# EAGLE design flute (EAGLE 6.1)
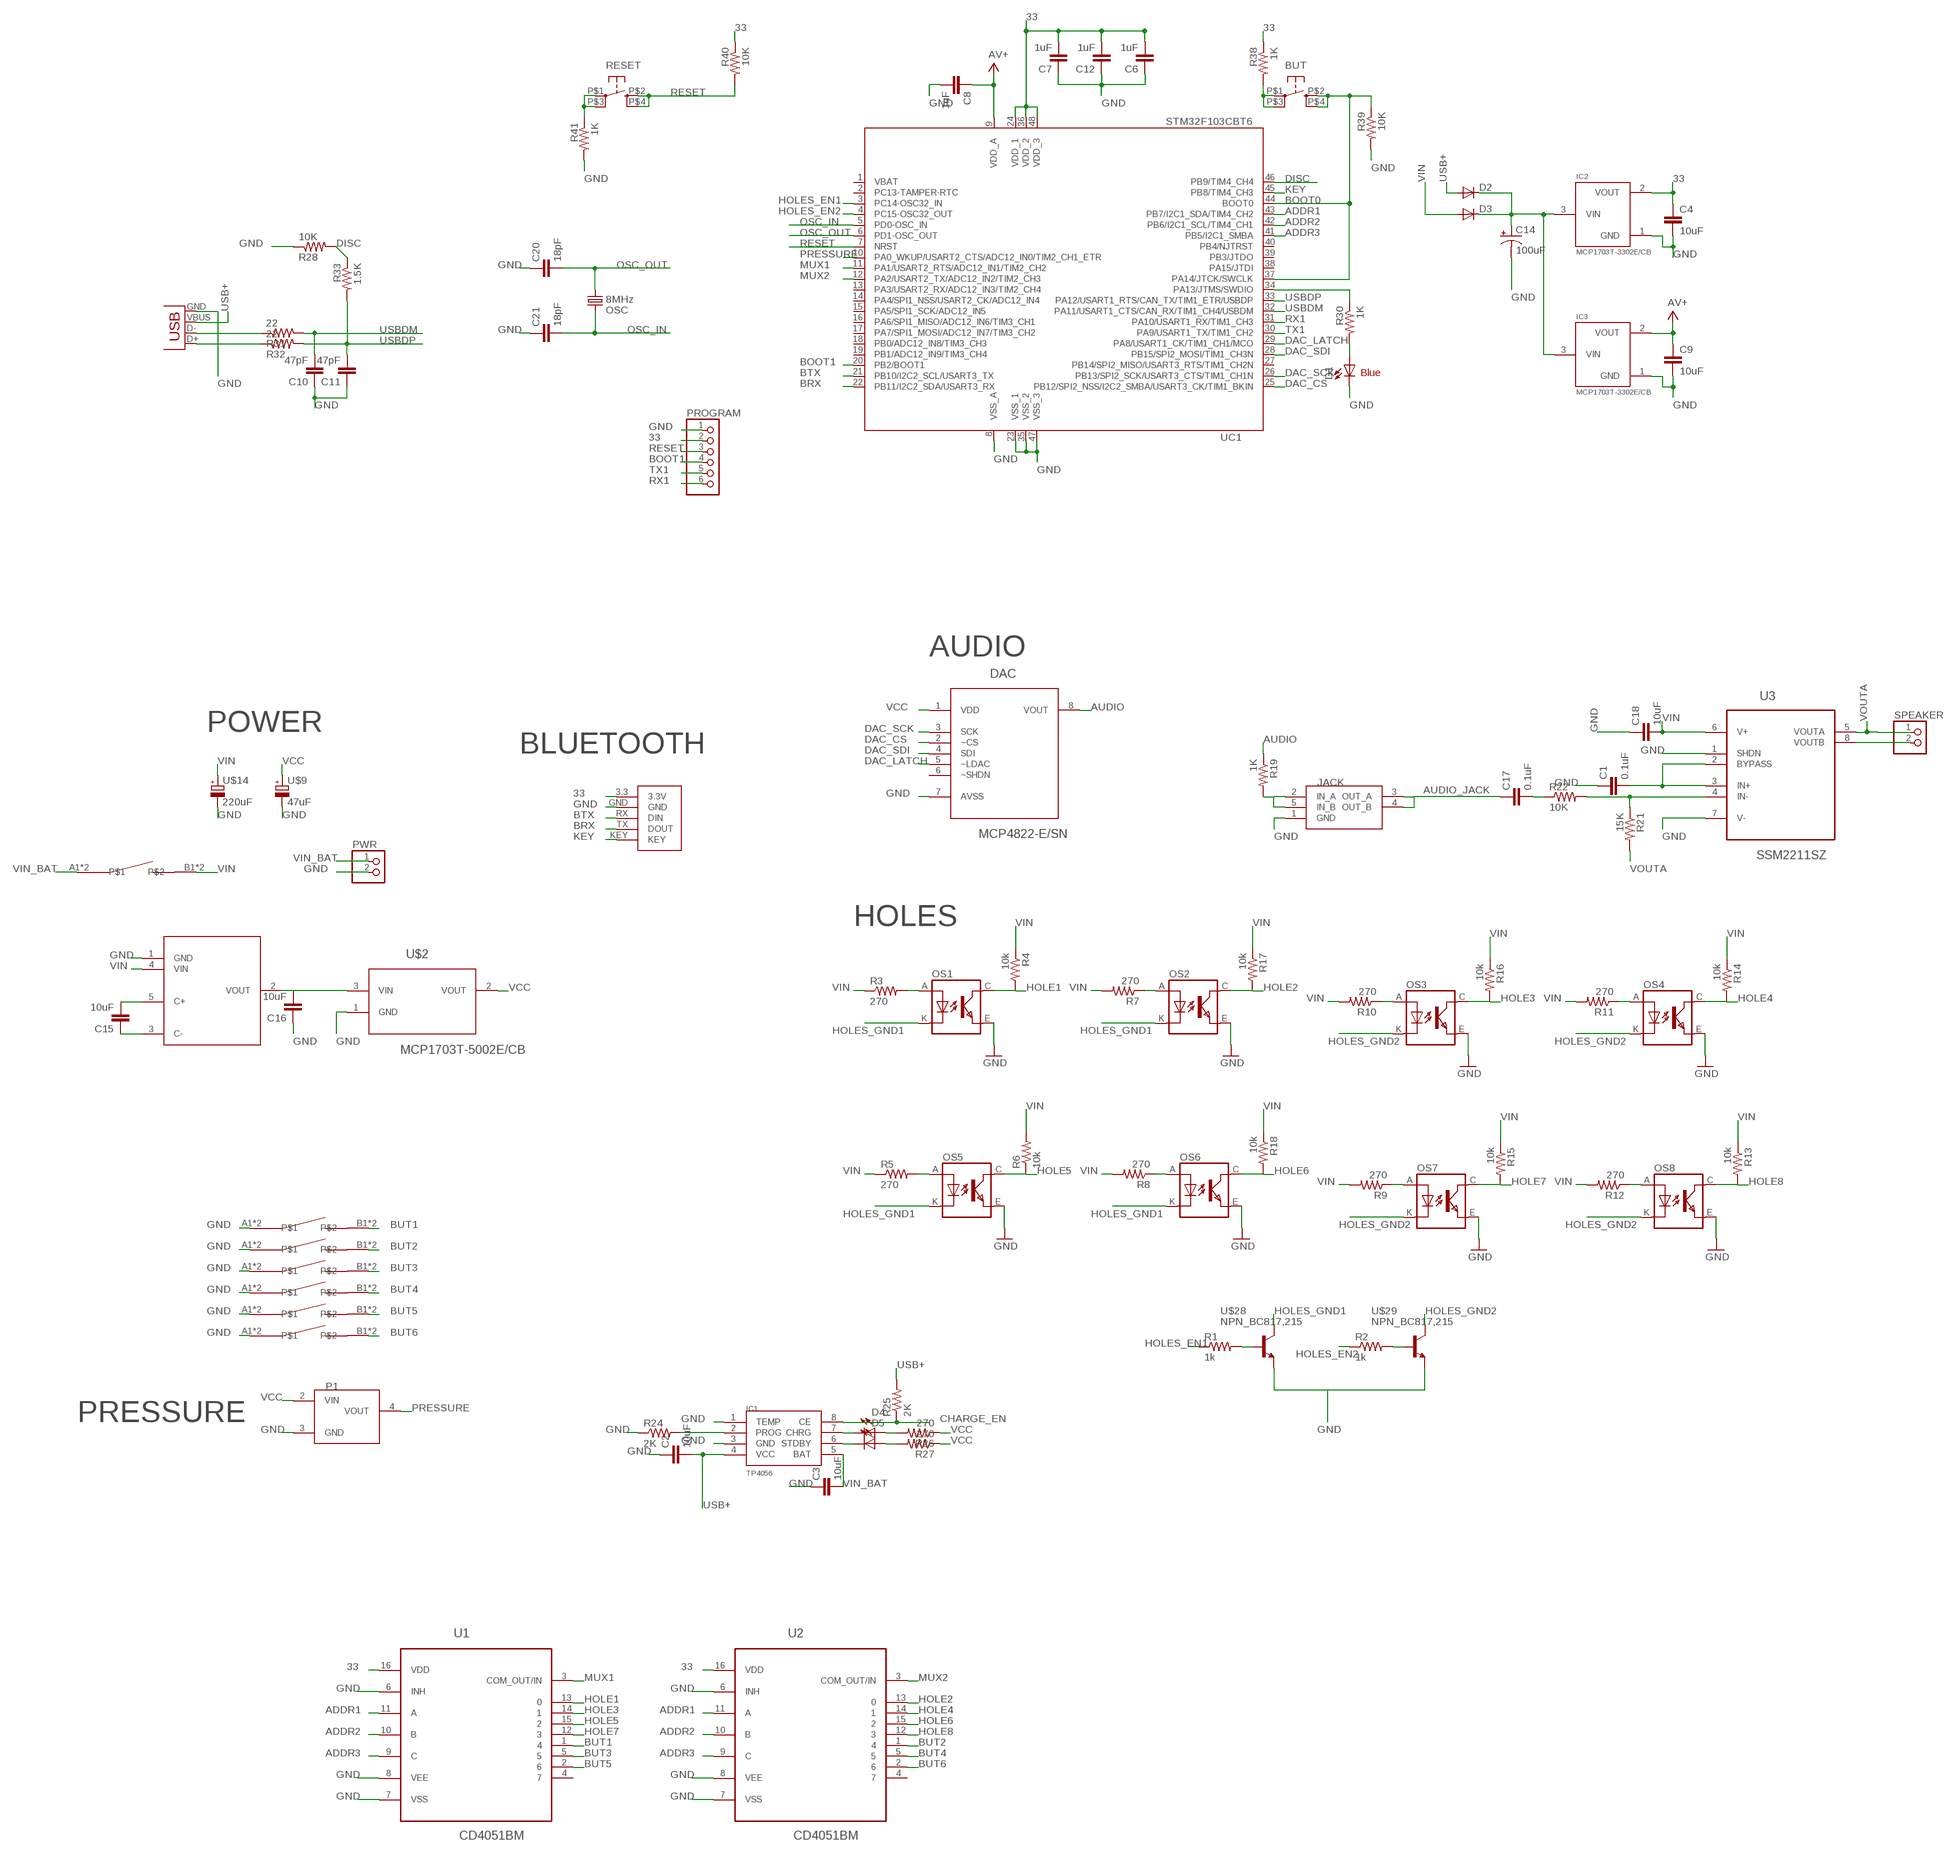
[diagram p0: schematic, sheet 1]

## Parts
BUT  KMR211GLFS  BUTTON-KMR241GLFS  [PUSHBUTTON-KMR241GLFS]
C1  0.1uF  CAP0805  [0805]
C2  10uF  CAP0805  [0805]
C3  10uF  CAP0805  [0805]
C4  10uF  CAP0805  [0805]
C6  1uF  CAP0805  [0805]
C7  1uF  CAP0805  [0805]
C8  1uF  CAP0805  [0805]
C9  10uF  CAP0805  [0805]
C10  47pF  CAP0805  [0805]
C11  47pF  CAP0805  [0805]
C12  1uF  CAP0805  [0805]
C14  100uF  CAP_POL1206  [EIA3216]
C15  10uF  CAP0805  [0805]
C16  10uF  CAP0805  [0805]
C17  0.1uF  CAP0805  [0805]
C18  10uF  CAP0805  [0805]
C20  18pF  CAP0805  [0805]
C21  18pF  CAP0805  [0805]
D1  Blue  LED1206  [LED-1206]
D2  DIODESOD  [SOD-323]
D3  DIODESOD  [SOD-323]
D4  Red  LED1206  [LED-1206]
D5  Green  LED1206  [LED-1206]
DAC  MCP4822-E/SN  [SOIC8-N_MC]
IC1  TP4056  [SOP-8]
IC2  MCP1703T-3302E/CB  MCP1700T  [SOT23]
IC3  MCP1703T-3302E/CB  MCP1700T  [SOT23]
JACK  JACK  [3F07]
OS1  TCRT5000  [TCRT5000]
OS2  TCRT5000  [TCRT5000]
OS3  TCRT5000  [TCRT5000]
OS4  TCRT5000  [TCRT5000]
OS5  TCRT5000  [TCRT5000]
OS6  TCRT5000  [TCRT5000]
OS7  TCRT5000  [TCRT5000]
OS8  TCRT5000  [TCRT5000]
OSC  8MHz  CRYSTAL5X3  [CRYSTAL-SMD-5X3]
P1  PRESSURE_SENSOR  [MPXV5050GP]
PROGRAM  CONNEC_1X066PADS  [6PADS]
PWR  CONNEC_1X02BASIC  [CONNEC_1X02]
R1  1k  RESISTOR0805-RES  [0805]
R2  1k  RESISTOR0805-RES  [0805]
R3  270  RESISTOR0805-RES  [0805]
R4  10k  RESISTOR0805-RES  [0805]
R5  270  RESISTOR0805-RES  [0805]
R6  10k  RESISTOR0805-RES  [0805]
R7  270  RESISTOR0805-RES  [0805]
R8  270  RESISTOR0805-RES  [0805]
R9  270  RESISTOR0805-RES  [0805]
R10  270  RESISTOR0805-RES  [0805]
R11  270  RESISTOR0805-RES  [0805]
R12  270  RESISTOR0805-RES  [0805]
R13  10k  RESISTOR0805-RES  [0805]
R14  10k  RESISTOR0805-RES  [0805]
R15  10k  RESISTOR0805-RES  [0805]
R16  10k  RESISTOR0805-RES  [0805]
R17  10k  RESISTOR0805-RES  [0805]
R18  10k  RESISTOR0805-RES  [0805]
R19  1K  RESISTOR0805-RES  [0805]
R21  15K  RESISTOR0805-RES  [0805]
R22  10K  RESISTOR0805-RES  [0805]
R24  2K  RESISTOR0805-RES  [0805]
R25  2K  RESISTOR0805-RES  [0805]
R26  270  RESISTOR0805-RES  [0805]
R27  270  RESISTOR0805-RES  [0805]
R28  10K  RESISTOR0805-RES  [0805]
R30  1K  RESISTOR0805-RES  [0805]
R31  22  RESISTOR0805-RES  [0805]
R32  22  RESISTOR0805-RES  [0805]
R33  1.5K  RESISTOR0805-RES  [0805]
R38  1K  RESISTOR0805-RES  [0805]
R39  10K  RESISTOR0805-RES  [0805]
R40  10K  RESISTOR0805-RES  [0805]
R41  1K  RESISTOR0805-RES  [0805]
RESET  KMR211GLFS  BUTTON-KMR241GLFS  [PUSHBUTTON-KMR241GLFS]
SPEAKER  CONNEC_1X02BASIC  [CONNEC_1X02]
U1  CD4051BM  [SOIC127P600X175-16N]
U2  CD4051BM  [SOIC127P600X175-16N]
U3  SSM2211SZ  [SOIC127P600X175-8N]
U$1  MAX1683  [SOT23-5]
U$2  MCP1703T-5002E/CB  [SOT95P300X145-3N]
U$9  47uF  CPOL_EUPANASONIC_D  [PANASONIC_D]
U$14  220uF  CPOL_EUPANASONIC_D8  [PANASONIC_D8]
U$16  SWITCHKCD11  [KCD11]
U$18  SWITCH6X6X10  [SWITCH_6X6X10]
U$19  SWITCH6X6X10  [SWITCH_6X6X10]
U$20  SWITCH6X6X10  [SWITCH_6X6X10]
U$21  SWITCH6X6X10  [SWITCH_6X6X10]
U$22  SWITCH6X6X10  [SWITCH_6X6X10]
U$23  SWITCH6X6X10  [SWITCH_6X6X10]
U$24  HC05  [HC-05]
U$28  NPN_BC817,215  [SOT-23]
U$29  NPN_BC817,215  [SOT-23]
UC1  STM32F103CBT6  STM32F103CB  [LQFP48]
X1  USB-MINIB  USBSMD  [USB-MINIB]

## Nets
32: BUT.P$2 BUT.P$4 R39.1 UC1.37(PA14/JTCK/SWCLK) UC1.44(BOOT0)
33: C4.1 C6.2 C7.2 C12.2 IC2.2(VOUT) PROGRAM.2 R38.1 R40.1 U1.16(VDD) U2.16(VDD) U$24.3.3(3.3V) UC1.24(VDD_1) UC1.36(VDD_2) UC1.48(VDD_3)
ADDR1: U1.11(A) U2.11(A) UC1.43(PB7/I2C1_SDA/TIM4_CH2)
ADDR2: U1.10(B) U2.10(B) UC1.42(PB6/I2C1_SCL/TIM4_CH1)
ADDR3: U1.9(C) U2.9(C) UC1.41(PB5/I2C1_SMBA)
AUDIO: DAC.8(VOUT) R19.1
AUDIO_JACK: C17.1 JACK.3(OUT_A) JACK.4(OUT_B)
AV+: C8.1 C9.1 IC3.2(VOUT) UC1.9(VDD_A)
BOOT1: PROGRAM.4 UC1.20(PB2/BOOT1)
BRX: U$24.TX(DOUT) UC1.22(PB11/I2C2_SDA/USART3_RX)
BTX: U$24.RX(DIN) UC1.21(PB10/I2C2_SCL/USART3_TX)
BUT1: U1.1 U$18.B1 U$18.B2
BUT2: U2.1 U$19.B1 U$19.B2
BUT3: U1.5 U$20.B1 U$20.B2
BUT4: U2.5 U$21.B1 U$21.B2
BUT5: U1.2 U$22.B1 U$22.B2
BUT6: U2.2 U$23.B1 U$23.B2
CHARGE_EN: IC1.8(CE) R25.1
DAC_CS: DAC.2(~CS) UC1.25(PB12/SPI2_NSS/I2C2_SMBA/USART3_CK/TIM1_BKIN)
DAC_LATCH: DAC.5(~LDAC) UC1.29(PA8/USART1_CK/TIM1_CH1/MCO)
DAC_SCK: DAC.3(SCK) UC1.26(PB13/SPI2_SCK/USART3_CTS/TIM1_CH1N)
DAC_SDI: DAC.4(SDI) UC1.28(PB15/SPI2_MOSI/TIM1_CH3N)
DISC: R28.2 R33.1 UC1.46(PB9/TIM4_CH4)
GND [alim]: C1.1 C2.1 C3.1 C4.2 C6.1 C7.1 C8.2 C9.2 C10.1 C11.1 C12.1 C14.C(-) C16.1 C18.1 C20.1 C21.1 D1.C DAC.7(AVSS) IC1.1(TEMP) IC1.3(GND) IC2.1(GND) IC3.1(GND) JACK.1(GND) OS1.E(EMITTER) OS2.E(EMITTER) OS3.E(EMITTER) OS4.E(EMITTER) OS5.E(EMITTER) OS6.E(EMITTER) OS7.E(EMITTER) OS8.E(EMITTER) P1.3(GND) PROGRAM.1 PWR.2 R24.1 R28.1 R39.2 R41.2 U1.6(INH) U1.7(VSS) U1.8(VEE) U2.6(INH) U2.7(VSS) U2.8(VEE) U3.1(SHDN) U3.7(V-) U$1.1(GND) U$2.1(GND) U$9.- U$14.- U$18.A1 U$18.A2 U$19.A1 U$19.A2 U$20.A1 U$20.A2 U$21.A1 U$21.A2 U$22.A1 U$22.A2 U$23.A1 U$23.A2 U$24.GND U$28.2(E) U$29.2(E) UC1.8(VSS_A) UC1.23(VSS_1) UC1.35(VSS_2) UC1.47(VSS_3) X1.GND
HOLE1: OS1.C(COLLECTOR) R4.2 U1.13
HOLE2: OS2.C(COLLECTOR) R17.2 U2.13
HOLE3: OS3.C(COLLECTOR) R16.2 U1.14
HOLE4: OS4.C(COLLECTOR) R14.2 U2.14
HOLE5: OS5.C(COLLECTOR) R6.1 U1.15
HOLE6: OS6.C(COLLECTOR) R18.2 U2.15
HOLE7: OS7.C(COLLECTOR) R15.2 U1.12
HOLE8: OS8.C(COLLECTOR) R13.2 U2.12
HOLES_EN1: R1.1 UC1.3(PC14-OSC32_IN)
HOLES_EN2: R2.1 UC1.4(PC15-OSC32_OUT)
HOLES_GND1: OS1.K(CATHODE) OS2.K(CATHODE) OS5.K(CATHODE) OS6.K(CATHODE) U$28.3(C)
HOLES_GND2: OS3.K(CATHODE) OS4.K(CATHODE) OS7.K(CATHODE) OS8.K(CATHODE) U$29.3(C)
KEY: U$24.KEY UC1.45(PB8/TIM4_CH3)
MUX1: U1.3(COM_OUT/IN) UC1.11(PA1/USART2_RTS/ADC12_IN1/TIM2_CH2)
MUX2: U2.3(COM_OUT/IN) UC1.12(PA2/USART2_TX/ADC12_IN2/TIM2_CH3)
N$1: C1.2 U3.2(BYPASS) U3.3(IN+)
N$2: R21.1 R22.2 U3.4(IN-)
N$3: R1.2 U$28.1(B)
N$4: R2.2 U$29.1(B)
N$5: OS1.A(ANODE) R3.2
N$6: D5.A R27.2
N$7: OS2.A(ANODE) R7.1
N$8: JACK.2(IN_A) JACK.5(IN_B) R19.2
N$9: OS3.A(ANODE) R10.1
N$10: C17.2 R22.1
N$11: OS4.A(ANODE) R11.1
N$12: SPEAKER.2 U3.8(VOUTB)
N$13: OS5.A(ANODE) R5.2
N$15: OS6.A(ANODE) R8.1
N$16: D4.A R26.2
N$17: OS7.A(ANODE) R9.1
N$19: OS8.A(ANODE) R12.1
N$21: IC1.2(PROG) R24.2
N$22: C15.1 U$1.3(C-)
N$24: D4.C IC1.7(CHRG)
N$25: D5.C IC1.6(STDBY)
N$26: BUT.P$1 BUT.P$3 R38.2
N$27: R41.1 RESET.P$1 RESET.P$3
N$28: D1.A R30.2
N$29: R30.1 UC1.34(PA13/JTMS/SWDIO)
N$30: C15.2 U$1.5(C+)
N$31: C16.2 U$1.2(VOUT) U$2.3(VIN)
N$59: R31.1 X1.D-
N$60: R32.1 X1.D+
OSC_IN: C21.2 OSC.3 UC1.5(PD0-OSC_IN)
OSC_OUT: C20.2 OSC.1 UC1.6(PD1-OSC_OUT)
PRESSURE: P1.4(VOUT) UC1.10(PA0_WKUP/USART2_CTS/ADC12_IN0/TIM2_CH1_ETR)
RESET: PROGRAM.3 R40.2 RESET.P$2 RESET.P$4 UC1.7(NRST)
RX1: PROGRAM.6 UC1.31(PA10/USART1_RX/TIM1_CH3)
TX1: PROGRAM.5 UC1.30(PA9/USART1_TX/TIM1_CH2)
USB+: C2.2 D2.2(A) IC1.4(VCC) R25.2 X1.VBUS
USBDM: C10.2 R31.2 UC1.32(PA11/USART1_CTS/CAN_RX/TIM1_CH4/USBDM)
USBDP: C11.2 R32.2 R33.2 UC1.33(PA12/USART1_RTS/CAN_TX/TIM1_ETR/USBDP)
VCC [alim]: DAC.1(VDD) P1.2(VIN) R26.1 R27.1 U$2.2(VOUT) U$9.+
VIN [alim]: C18.2 D3.2(A) R3.1 R4.1 R5.1 R6.2 R7.2 R8.2 R9.2 R10.2 R11.2 R12.2 R13.1 R14.1 R15.1 R16.1 R17.1 R18.1 U3.6(V+) U$1.4(VIN) U$14.+ U$16.B1 U$16.B2
VIN_BAT [alim]: C3.2 IC1.5(BAT) PWR.1 U$16.A1 U$16.A2
VIN_REGS [alim]: C14.A(+) D2.1(C) D3.1(C) IC2.3(VIN) IC3.3(VIN)
VOUTA: R21.2 SPEAKER.1 U3.5(VOUTA)
Unconnected: DAC.6(~SHDN) U1.4 U2.4 UC1.2(PC13-TAMPER-RTC) UC1.13(PA3/USART2_RX/ADC12_IN3/TIM2_CH4) UC1.14(PA4/SPI1_NSS/USART2_CK/ADC12_IN4) UC1.15(PA5/SPI1_SCK/ADC12_IN5) UC1.16(PA6/SPI1_MISO/ADC12_IN6/TIM3_CH1) UC1.17(PA7/SPI1_MOSI/ADC12_IN7/TIM3_CH2) UC1.18(PB0/ADC12_IN8/TIM3_CH3) UC1.19(PB1/ADC12_IN9/TIM3_CH4) UC1.27(PB14/SPI2_MISO/USART3_RTS/TIM1_CH2N) UC1.38(PA15/JTDI) UC1.39(PB3/JTDO) UC1.40(PB4/NJTRST)

## Notes on the sheet
- BOOT0
- Blue
- AUDIO
- POWER
- BLUETOOTH
- HOLES
- PRESSURE

## Power pins joined to a net without a drawn wire
VBAT: UC1.1(VBAT)

## Library data of the parts
BUT RESET = okie:BUTTON-KMR241GLFS
C1-C3 C6-C8 C10-C12 C15-C18 C20 C21 = SparkFun-Passives:CAP: Capacitor Standard 0603 ceramic capacitor, and 0.1" leaded capacitor.
C4 C9 = SparkFun2:CAP: Capacitor Standard 0603 ceramic capacitor, and 0.1" leaded capacitor.
C14 = SparkFun3:CAP_POL: Capacitor Polarized These are standard SMD and PTH capacitors. Normally 10uF, 47uF, and 100uF in electrolytic and tantalum varieties. Always verify the external diameter of the through hole cap, it varies with capacity, voltage, and manufacturer. The EIA devices should be standard.
D1 D4 D5 = SparkFun:LED: LEDs Standard schematic elements and footprints for 5mm, 3mm, 1206, and 0603 sized LEDs. 5mm - Spark Fun Electronics SKU : COM-00529 (and others)
D2 D3 = SparkFun3:DIODE: Diode These are standard reverse protection diodes and small signal diodes. SMA package can handle up to about 1A. SOD-323 can handle about 200mA. What the SOD-323 package when ordering, there are some mfgs out there that are 5-pin packages.
DAC = rhoban:MCP4822-E/SN: 12 Bit DAC; DESCRIPTION: 12 Bit DAC; MPN: MCP4822-E/SN; OC_FARNELL: 1439414; OC_NEWARK: 31K2975; PACKAGE: SOIC-8; SUPPLIER: Microchip
IC1 = TP4056:TP4056
IC2 IC3 = okie:MCP1700T
JACK = rhoban:JACK
OS1-OS8 = tcrt5000:TCRT5000
OSC = SparkFun2:CRYSTAL: Crystals Various standard crystals. Proven footprints. Spark Fun Electronics SKU : COM-00534
P1 = rhoban:PRESSURE_SENSOR
PROGRAM = rhoban:CONNEC_1X06
PWR SPEAKER = rhoban:CONNEC_1X02
R1-R19 R21 R22 R24-R28 R30-R33 R38-R41 = SparkFun-Passives:RESISTOR: Resistor Basic schematic elements and footprints for 0603, 1206, and PTH resistors.
U1 U2 = rhoban:CD4051BM: CMOS Analog Multiplexers/Demultiplexers with Logic Level Conversion; MPN: CD4051BM; OC_FARNELL: 8388970; OC_NEWARK: 05B5595; PACKAGE: SOIC-16; SUPPLIER: Texas Instruments
U3 = rhoban:SSM2211SZ: Low Distortion, 1.5 W Audio Power Amplifier; MPN: SSM2211SZ; OC_FARNELL: 9994440; OC_NEWARK: 19M1049; PACKAGE: SOIC-8; SUPPLIER: Analog Devices
U$1 = rhoban:MAX1683
U$2 = rhoban:MCP1703T-5002E/CB: Low Quiescent Current LDO Regulator; MPN: MCP1703T-5002E/CB; OC_FARNELL: 1439519; OC_NEWARK: 40M0640; PACKAGE: SOT-3; SUPPLIER: Microchip
U$9 U$14 = rhoban:CPOL_EU: 47uF: http://fr.farnell.com/panasonic-electronic-components/eee1ca470sp/condensateur-elec-alu-47uf-16v/dp/9696946 220uF: http://fr.farnell.com/panasonic-electronic-components/eeefk1c221xp/condensateur-elec-alu-220uf-16v/dp/1850103
U$16 U$18-U$23 = rhoban:SWITCH
U$24 = rhoban:HC05
U$28 U$29 = rhoban:NPN
UC1 = stm32:STM32F103CB
X1 = SparkFun2:USB: USB Connectors USB-B-PTH is fully proven SKU : PRT-00139 USB-miniB is fully proven SKU : PRT-00587 USB-A-PCB is untested. USB-A-H is throughly reviewed, but untested. Spark Fun Electronics SKU : PRT-00437 USB-B-SMT is throughly reviewed, but untested. Needs silkscreen touching up. USB-A-S has not been used/tested USB-MB-H has not been used/tested

## Net classes
1 alim: width 0.381 mm, clearance 0.076 mm

## Board
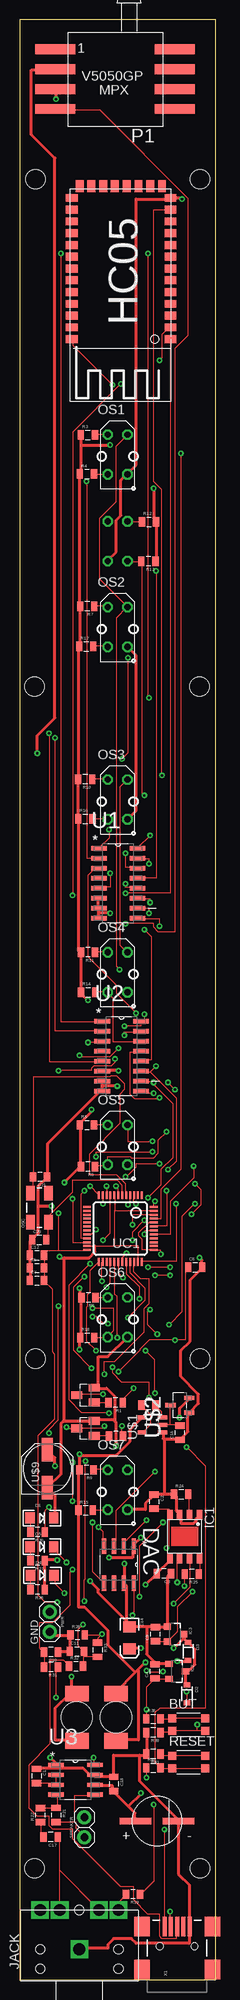
[diagram p1: board, top side]
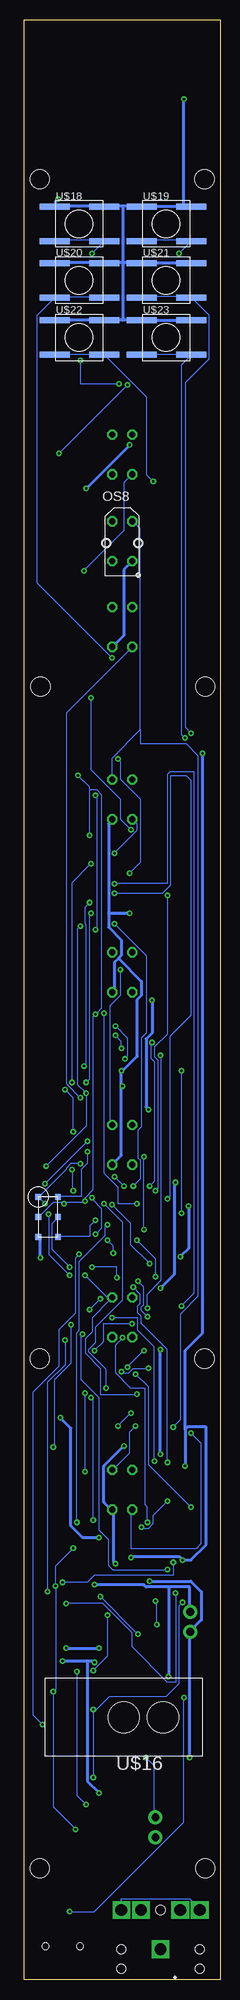
[diagram p2: board, bottom side, seen from below]

Size 25 x 250 mm. Coordinates in mm from the lower left corner, seen from the top.
Outline: 0,0 25,0 25,250 0,250 0,0
Copper layers (1*16): Top 0.035mm / dielectric 1.5mm / Bottom 0.035mm
Design rules: minimum track width 6mil, minimum drill 0.3mm, track to track 0.205mm, track to pad 0.205mm, pad to pad 0.205mm, via to via 0.205mm, smd to smd 8mil, copper to edge 40mil, drill to drill 8mil, minimum pad ring 10mil, minimum via ring 8mil, stop-mask expansion 4mil, vias tented up to drill 25mil, thermal gap 10mil
Holes 2.5 mm at 22.92,164.94 1.92,164.94 23.02,14.24 1.92,14.24 23.02,229.64 2.02,229.64 23.02,79.24 2.02,79.24
tRestrict: area 21.6,163.6 to 24.3,166.2; area 0.6,163.6 to 3.3,166.2; area 21.7,12.9 to 24.4,15.5; area 0.6,12.9 to 3.3,15.5; area 21.7,228.3 to 24.4,230.9; area 0.7,228.3 to 3.4,230.9; area 21.7,77.9 to 24.4,80.5; area 0.7,77.9 to 3.4,80.5
bRestrict: area 21.6,163.6 to 24.3,166.2; area 0.6,163.6 to 3.3,166.2; area 21.7,12.9 to 24.4,15.5; area 0.6,12.9 to 3.3,15.5; area 21.7,228.3 to 24.4,230.9; area 0.7,228.3 to 3.4,230.9; area 21.7,77.9 to 24.4,80.5; area 0.7,77.9 to 3.4,80.5

### Footprints (pad centres in the part's own frame; a part is rotated, then mirrored left to right if it is on the bottom)
PUSHBUTTON-KMR241GLFS = smd 1 x 1: P$1 2.1,0.8; P$2 2.1,-0.8; P$3 -2.1,0.8; P$4 -2.1,-0.8
0805 = smd 0.8 x 1.2: 1 -0.9,0; 2 0.9,0
EIA3216 = smd 1.4 x 1.6: A 1.4,0; C -1.4,0
LED-1206 = smd 1.2 x 1.4: A -1.5,0; C 1.5,0
SOD-323 = smd 0.63 x 0.83: 1 -1.15,0; 2 1.15,0
SOIC8-N_MC = smd 1.981 x 0.559: 1 -2.362,1.905; 2 -2.362,0.635; 3 -2.362,-0.635; 4 -2.362,-1.905; 5 2.362,-1.905; 6 2.362,-0.635; 7 2.362,0.635; 8 2.362,1.905
SOP-8 = smd 1.3 x 0.7: 1 -2.75,1.905; 2 -2.75,0.635; 3 -2.75,-0.635; 4 -2.75,-1.905; 5 2.75,-1.905; 6 2.75,-0.635; 7 2.75,0.635; 8 2.75,1.905
SOT23 = smd 0.8 x 0.9: 1 -0.95,-1; 2 0.95,-1; 3 0,1.1
3F07 = drill 1.5 square: 1 0,0; 2 5,5; 3 5,2.5; 4 5,-2.5; 5 5,-5 | hole 1.2: 5,0; 0,-5; -2.5,-5; -2.5,5; 0,5
TCRT5000 = drill 0.8 octagon: A -2.54,-1.27; C 2.54,-1.27; E 2.54,1.27; K -2.54,1.27
CRYSTAL-SMD-5X3 = smd 1.9 x 1.1: 1 -1.85,-1.15; 2 1.85,-1.15; 3 1.85,1.15; 4 -1.85,1.15
MPXV5050GP = smd 5.08 x 1.27: 1 15.24,0; 2 15.24,2.54; 3 15.24,5.08; 4 15.24,7.62; 5 0,7.62; 6 0,5.08; 7 0,2.54; 8 0,0
6PADS = smd 0.762 x 0.762: 1 0,0; 2 0,2.54; 3 0,5.08; 4 2.54,5.08; 5 2.54,2.54; 6 2.54,0
CONNEC_1X02 = drill 1 pad 1.778: 1 -1.27,1.27; 2 1.27,1.27
SOIC127P600X175-16N = smd 1.981 x 0.559: 1 -2.464,4.445; 2 -2.464,3.175; 3 -2.464,1.905; 4 -2.464,0.635; 5 -2.464,-0.635; 6 -2.464,-1.905; 7 -2.464,-3.175; 8 -2.464,-4.445; 9 2.464,-4.445; 10 2.464,-3.175; 11 2.464,-1.905; 12 2.464,-0.635; 13 2.464,0.635; 14 2.464,1.905; 15 2.464,3.175; 16 2.464,4.445
SOIC127P600X175-8N = smd 1.981 x 0.559: 1 -2.464,1.905; 2 -2.464,0.635; 3 -2.464,-0.635; 4 -2.464,-1.905; 5 2.464,-1.905; 6 2.464,-0.635; 7 2.464,0.635; 8 2.464,1.905
SOT23-5 = smd 0.55 x 1.2: 1 -0.95,-1.3; 2 0,-1.3; 3 0.95,-1.3; 4 0.95,1.3; 5 -0.95,1.3
SOT95P300X145-3N = smd 0.559 x 1.321: 1 -0.94,-1.194; 2 0.94,-1.194; 3 0,1.194
PANASONIC_D = smd 3 x 1.4: + 2.4,0; - -2.4,0
PANASONIC_D8 = smd 4.016 x 0.8: + 2.73,0; - -2.73,0
KCD11 = smd 3 x 2 bottom: A1 0,3; A2 0,-3; B1 5,3; B2 5,-3 | hole 4: 0,0; 5,0
SWITCH_6X6X10 = smd 3.81 x 0.75: A1 -0.1,5.2; A2 6.2,5.2; B1 -0.1,0.8; B2 6.2,0.8
HC-05 = smd 1.5 x 1: 3.3 0,-16.5; GND 0,-18; KEY 12.6,0; P$3 0,-3; P$4 0,-4.5; P$5 0,-6; P$6 0,-7.5; P$7 0,-9; P$8 0,-10.5; P$9 0,-12; P$10 0,-13.5; P$11 0,-15; P$23 12.6,-1.5; P$24 12.6,-3; P$25 12.6,-4.5; P$26 12.6,-6; P$27 12.6,-7.5; P$28 12.6,-9; P$29 12.6,-10.5; P$30 12.6,-12; P$31 12.6,-13.5; P$32 12.6,-15; P$33 12.6,-16.5; P$34 12.6,-18; RX 0,-1.5; TX 0,0 | smd 1 x 1.5: P$14 1.1,-19.5; P$15 2.6,-19.5; P$16 4.1,-19.5; P$17 5.6,-19.5; P$18 7.1,-19.5; P$19 8.6,-19.5; P$20 10.1,-19.5; P$21 11.6,-19.5
SOT-23 = smd 1 x 1.4: 1 -0.95,-1.1; 2 0.95,-1.1; 3 0,1.1
LQFP48 = smd 0.254 x 1: 1 -2.75,-4.25; 2 -2.25,-4.25; 3 -1.75,-4.25; 4 -1.25,-4.25; 5 -0.75,-4.25; 6 -0.25,-4.25; 7 0.25,-4.25; 8 0.75,-4.25; 9 1.25,-4.25; 10 1.75,-4.25; 11 2.25,-4.25; 12 2.75,-4.25; 25 2.75,4.25; 26 2.25,4.25; 27 1.75,4.25; 28 1.25,4.25; 29 0.75,4.25; 30 0.25,4.25; 31 -0.25,4.25; 32 -0.75,4.25; 33 -1.25,4.25; 34 -1.75,4.25; 35 -2.25,4.25; 36 -2.75,4.25 | smd 1 x 0.254: 13 4.25,-2.75; 14 4.25,-2.25; 15 4.25,-1.75; 16 4.25,-1.25; 17 4.25,-0.75; 18 4.25,-0.25; 19 4.25,0.25; 20 4.25,0.75; 21 4.25,1.25; 22 4.25,1.75; 23 4.25,2.25; 24 4.25,2.75; 37 -4.25,2.75; 38 -4.25,2.25; 39 -4.25,1.75; 40 -4.25,1.25; 41 -4.25,0.75; 42 -4.25,0.25; 43 -4.25,-0.25; 44 -4.25,-0.75; 45 -4.25,-1.25; 46 -4.25,-1.75; 47 -4.25,-2.25; 48 -4.25,-2.75
USB-MINIB = smd 2.5 x 0.5: D+ 2.5,0; D- 2.5,0.8; GND 2.5,-1.6; ID 2.5,-0.8; VBUS 2.5,1.6 | smd 2.5 x 2: GND@1 -3,-4.5; GND@2 -3,4.5; GND@3 2.5,4.5; GND@4 2.5,-4.5 | hole 0.9: 0,2.2; 0,-2.2

### Placement (x,y rotation side)
BUT  21.55,32.55 0 top
C1  2.14,26.02 270 top
C2  17.15,61 270 top
C3  18.4,51.8 180 top
C4  17.25,39.35 90 top
C6  2.2,90.8 0 top
C7  2.2,89.2 0 top
C8  22.4,90.9 0 top
C9  17.3,44.1 90 top
C10  4,41.8 180 top
C11  7.3,41.9 0 top
C12  2.2,92.4 0 top
C14  14,43.6 270 top
C15  16.44,73.28 180 top
C16  20.44,69.78 90 top
C17  3.96,18.2 180 top
C18  12,25 270 top
C20  2.5,94.4 0 top
C21  2.6,102.4 180 top
D1  2.85,58.9 0 top
D2  21.35,36.5 270 top
D3  21.5,41.9 270 top
D4  2.9,51.6 0 top
D5  2.85,55.25 0 top
DAC  12.65,52.95 270 top
IC1  21.05,56.55 270 top
IC2  20.05,39.35 270 top
IC3  19.8,44.1 270 top
JACK  7.62,3.9 90 top
OS1  12.5,194.54 270 top
OS2  12.5,172.54 270 top
OS3  12.5,150.54 270 top
OS4  12.5,128.5 270 top
OS5  12.5,106.5 270 top
OS6  12.5,84.5 270 top
OS7  12.5,62.5 270 top
OS8  12.5,183.47 270 bottom
OSC  2.54,98.48 90 top
P1  19.8,246.22 180 top
PROGRAM  23.24,94.78 0 bottom
PWR  2.56,45.68 270 top
R1  12.24,73.6 180 top
R2  12.29,69.36 180 top
R3  8.7,197.04 0 top
R4  8.58,192.04 0 top
R5  8.58,109.03 0 top
R6  8.72,103.73 180 top
R7  8.62,175.17 180 top
R8  8.78,87.03 180 top
R9  8.53,65.04 180 top
R10  8.36,153.11 180 top
R11  8.72,131.04 180 top
R12  16.5,185.97 0 top
R13  16.42,180.91 180 top
R14  8.74,125.98 0 top
R15  8.42,59.89 0 top
R16  8.38,148.09 0 top
R17  8.5,170.07 0 top
R18  8.62,81.91 0 top
R19  14.46,10.92 180 top
R21  4.66,21.04 270 top
R22  2.66,21.02 90 top
R24  20.6,61.95 0 top
R25  21.95,51.75 180 top
R26  2.3,49.75 180 top
R27  2.3,53.45 180 top
R28  7.4,44 0 top
R30  2.3,57.1 180 top
R31  4,39.9 180 top
R32  7.2,40 0 top
R33  9.95,42.1 270 top
R38  17.05,33.3 0 top
R39  17.05,31.55 180 top
R40  17.05,27.05 0 top
R41  17.05,28.8 180 top
RESET  21.55,27.8 0 top
SPEAKER  9.54,19.46 90 top
U1  12.56,139.86 0 top
U2  13,117.8 0 top
U3  7.12,25.52 0 top
U$1  16.94,70.78 90 top
U$2  20.44,73.28 90 top
U$9  3.55,65.2 90 top
U$14  17.5,20.25 180 top
U$16  7.3,33.5 180 bottom
U$18  21,220.95 0 bottom
U$19  9.9,220.95 0 bottom
U$20  21,213.75 0 bottom
U$21  9.9,213.75 0 bottom
U$22  21,206.45 0 bottom
U$23  9.9,206.45 0 bottom
U$24  19.25,209.25 180 top
U$28  8.39,74.58 90 top
U$29  8.39,70.33 90 top
UC1  12.84,95.83 180 top
X1  20.09,4.31 90 top

### Tracks (layer width: path | path; a pad name or v marks a point on that pad's centre or on a via)
32  (via drill 0.3)
  Top 0.152: UC1.44 16.95,96.6 16.5,96.6 15.15,95.25 15.15,94.95 15.6,94.5 15.6,93.15 16.95,93.15 UC1.37 17.1,93 18,93 v18,92.55 | R39.1 18,31.65 19.35,31.65 BUT.P$4 19.5,31.8 22.65,31.8 | 22.65,31.8 23.55,31.8 BUT.P$2 | 22.65,31.8 v22.65,32.55
  Bottom 0.152: v18,92.55 18.45,92.1 18.45,85.05 20.55,82.95 20.55,78.3 23.85,75 23.85,33.75 v22.65,32.55
33  (via drill 0.3)
  Top 0.152: 4.95,93 3.15,93 3.15,92.4 | 4.95,93 8.55,93 UC1.24 | 3.15,92.4 3.15,90.9 C6.2 3.15,90.75 3.15,89.25 C7.2 3.15,89.1 4.2,88.05 4.2,80.1 4.5,79.8 4.5,71.55 2.4,69.45 2.4,49.05 3.3,48.15 v4.8,48.15 | 3.15,92.4 C12.2 | 17.25,38.4 IC2.2 | v16.2,25.8 16.2,27 R40.1 | R38.1 16.2,33.3 v16.2,34.5 16.2,37.35 17.25,38.4 | 17.25,38.4 C4.1 | v17.25,99.3 17.1,99.15 17.1,98.7 UC1.48 | v19.95,99 19.95,91.65 15.6,91.65 UC1.36 | v15.9,123.15 15.9,122.55 15.6,122.25 U2.16 15.45,122.1 15.45,121.65 v13.35,121.65 | U$24.3.3 17.1,225.75 17.1,191.1 18.15,190.05 v18.15,153.6 | v16.65,145.95 15.15,144.45 U1.16 | v4.95,97.8 4.95,93 | v4.95,115.95 9.15,115.95 9.15,116.25 9.45,116.55 11.7,116.55 12.15,117 v12.15,117.45
  Bottom 0.152: v16.2,34.5 16.2,34.05 | 16.2,34.05 v16.2,25.8 | v4.8,48.15 5.25,47.7 5.25,37.8 6.9,36.15 14.1,36.15 16.2,34.05 | 19.95,99.15 17.25,99.15 v17.25,99.3 17.25,99.75 16.2,100.8 16.2,122.85 v15.9,123.15 15.15,123.9 15.15,151.2 15.75,151.8 16.65,151.8 | 19.95,99.15 21.3,99.15 23.1,97.35 PROGRAM.2 | 19.95,99.15 v19.95,99 | v18.15,153.6 16.65,152.1 16.65,151.8 | v16.65,145.95 16.65,151.8 | v4.95,115.95 v4.95,97.8 | v12.15,117.45 11.85,117.75 11.85,120.15 v13.35,121.65
ADDR1  (via drill 0.3)
  Top 0.152: v18.75,100.65 18.75,96.15 17.1,96.15 UC1.43 | v18.9,103.35 19.95,104.4 19.95,112.5 16.65,115.8 | 16.65,115.8 15.6,115.8 U2.11 | v16.65,137.4 16.65,137.85 15.15,137.85 U1.11 | 16.65,115.8 v17.4,116.55
  Bottom 0.152: v18.75,100.65 18.9,100.8 v18.9,103.35 | v16.65,137.4 17.25,136.8 17.25,134.7 17.1,134.55 17.1,116.85 v17.4,116.55
ADDR2  (via drill 0.3)
  Top 0.152: v15.9,95.1 16.05,95.25 16.05,95.55 16.95,95.55 UC1.42 | v16.35,99.75 18,101.4 18,103.35 19.5,104.85 19.5,111.75 16.95,114.3 | 16.95,114.3 16.65,114.6 15.6,114.6 U2.10 | v16.5,136.05 16.5,136.65 15.15,136.65 U1.10 | 16.95,114.3 v17.1,114.45
  Bottom 0.152: v15.9,95.1 15.15,95.85 15.15,98.4 16.35,99.6 v16.35,99.75 | v16.5,136.05 16.65,135.9 16.65,114.9 v17.1,114.45
ADDR3  (via drill 0.3)
  Top 0.152: v22.2,103.8 22.2,102.3 19.2,99.3 19.2,95.1 17.1,95.1 UC1.41 | v17.1,113.1 15.6,113.1 15.6,113.25 U2.9 | v17.85,134.4 17.85,135.3 15.15,135.3 U1.9
  Bottom 0.152: v22.2,103.8 17.1,108.9 v17.1,113.1 18.15,114.15 18.15,134.1 v17.85,134.4
AUDIO  (via drill 0.3)
  Top 0.152: v17.1,22.35 17.1,12.6 15.45,10.95 R19.1 | v18.3,39.3 16.2,39.3 v16.2,39.45 | v14.4,46.5 14.55,46.65 14.55,50.55 DAC.8
  Bottom 0.152: v17.1,22.35 18.3,23.55 v18.3,39.3 | v16.2,39.45 14.4,41.25 v14.4,46.5
AUDIO_JACK
  Top 0.152: 5.1,13.95 5.1,9 JACK.3 | 5.1,13.95 5.1,18 4.95,18.15 C17.1 | 5.1,13.95 10.05,9 JACK.4
AV+  (via drill 0.3)
  Top 0.152: C9.1 18.75,43.2 IC3.2 18.9,43.2 20.1,44.4 20.1,47.55 v22.05,49.5 | v10.65,94.35 11.55,95.25 11.55,100.05 UC1.9 | v8.25,89.7 6.9,88.35 6.9,80.25 v9.15,78 | v12.6,77.55 15.3,80.25 15.3,80.4 16.5,81.6 v19.8,81.6 21.15,81.6 21.15,90.6 21.45,90.9 C8.1
  Bottom 0.152: v10.65,94.35 8.25,91.95 v8.25,89.7 | v9.15,78 11.1,78 11.7,77.4 12.6,77.4 v12.6,77.55 | v22.05,49.5 22.05,76.2 19.8,78.45 v19.8,81.6
BOOT1  (via drill 0.3)
  Top 0.152: v16.95,105.6 9.75,105.6 v9.75,105 | v9.75,95.7 9.15,95.1 8.7,95.1 UC1.20
  Bottom 0.152: v16.95,105.6 16.95,104.1 17.7,103.35 17.7,99.9 20.55,99.9 PROGRAM.4 | v9.75,95.7 v9.75,105
BRX  (via drill 0.3)
  Top 0.152: v6.75,99.6 6.75,94.05 8.55,94.05 UC1.22 | v13.5,138.6 19.2,138.6 19.2,209.25 U$24.TX
  Bottom 0.152: v6.75,99.6 6.45,99.9 6.45,120.3 3.75,123 3.75,153 4.35,153.6 6.3,153.6 6.3,139.65 7.35,138.6 v13.5,138.6
BTX  (via drill 0.3)
  Top 0.152: v8.25,100.65 7.8,100.2 7.8,94.65 8.55,94.65 UC1.21 | v6.75,138.3 6.75,197.4 v12.9,203.55 | v17.85,206.55 18.15,206.85 18.15,209.85 19.05,210.75 U$24.RX
  Bottom 0.152: v8.25,100.65 7.95,100.95 7.95,117.3 8.4,117.75 8.4,118.95 6.75,120.6 v6.75,138.3 | v12.9,203.55 17.85,203.55 v17.85,206.55
BUT1  (via drill 0.3)
  Top 0.152: v11.4,146.7 11.4,145.65 10.2,144.45 U1.1 | v16.5,163.5 16.35,163.65 v16.35,220.2
  Bottom 0.152: v11.4,146.7 12.75,148.05 12.75,150.6 16.5,154.35 v16.5,163.5 | v16.35,220.2 U$18.B2 14.85,221.85 21,221.85 U$18.B1
BUT2  (via drill 0.3)
  Top 0.152: v5.25,220.2 5.25,122.25 10.5,122.25 U2.1
  Bottom 0.152: v5.25,220.2 U$19.B2 3.75,221.85 9.9,221.85 U$19.B1
BUT3  (via drill 0.3)
  Top 0.152: v11.55,141.15 11.55,139.35 10.2,139.35 U1.5 | v13.05,155.7 13.8,156.45 v13.8,168.6
  Bottom 0.152: v11.55,141.15 10.2,142.5 10.2,150.6 12.75,153.15 12.75,155.4 v13.05,155.7 | v13.8,168.6 23.4,178.2 23.4,212.25 U$20.B1 21,214.65 14.85,214.65 U$20.B2
BUT4  (via drill 0.3)
  Top 0.152: v3.75,159 3.75,117.15 10.5,117.15 U2.5
  Bottom 0.152: v3.75,159 4.5,159.75 4.5,203.7 1.5,206.7 1.5,212.4 3.6,214.5 U$21.B2 3.75,214.65 9.9,214.65 U$21.B1
BUT5  (via drill 0.3)
  Top 0.152: v8.55,191.1 8.55,143.1 10.05,143.1 U1.2
  Bottom 0.152: v8.55,191.1 9.45,192 9.45,201.9 U$22.B2 14.85,207.3 21,207.3 U$22.B1
BUT6  (via drill 0.3)
  Top 0.152: v4.5,158.4 4.5,121.05 10.5,121.05 U2.2
  Bottom 0.152: v4.5,158.4 4.95,158.85 4.95,205.95 3.75,207.15 U$23.B2 3.75,207.3 9.9,207.3 U$23.B1
CHARGE_EN
  Top 0.152: R25.1 22.95,51.75 22.95,53.7 IC1.8
DAC_CS  (via drill 0.3)
  Top 0.152: v9.75,80.25 8.55,81.45 8.55,85.8 8.7,85.95 8.7,87.45 9,87.75 9,90.45 10.05,91.5 UC1.25 | v11.85,78.15 11.85,77.4 13.05,76.2 16.5,76.2 v16.5,74.25 | v16.2,58.65 13.35,55.8 13.35,55.35 DAC.2
  Bottom 0.152: v11.85,78.15 v9.75,80.25 | v16.5,74.25 16.2,73.95 v16.2,58.65
DAC_LATCH  (via drill 0.3)
  Top 0.152: v12.45,81.9 12.45,87.15 12.15,87.45 12.15,91.5 UC1.29 | v9.3,58.35 9.3,52.05 10.65,50.7 DAC.5
  Bottom 0.152: v12.45,81.9 13.35,81 13.35,77.4 11.4,75.45 9.6,75.45 9.6,60.6 9.3,60.3 v9.3,58.35
DAC_SCK  (via drill 0.3)
  Top 0.152: v10.5,89.1 10.5,91.5 UC1.26 | v9.3,84.6 9.75,84.6 10.65,83.7 v11.25,83.7 | v16.05,80.25 17.25,79.05 v17.25,74.85 | v17.25,64.8 12.3,59.85 12.3,55.5 12.15,55.35 DAC.3
  Bottom 0.152: v10.5,89.1 9.75,88.35 9.75,86.1 10.05,85.8 10.05,85.35 v9.3,84.6 | v11.25,83.7 14.85,83.7 14.85,81.45 v16.05,80.25 | v17.25,64.8 v17.25,74.85
DAC_SDI  (via drill 0.3)
  Top 0.152: v11.1,88.35 11.55,88.8 11.55,91.5 UC1.28 | v6.75,61.05 v6.75,66 | v10.05,57.75 10.65,57.15 10.65,55.35 DAC.4
  Bottom 0.152: v11.1,88.35 10.2,87.45 10.2,86.25 10.5,85.95 10.5,85.05 10.05,84.6 10.05,83.7 6.75,80.4 v6.75,66 | v6.75,61.05 8.55,59.25 8.55,58.2 9.15,57.6 10.05,57.6 v10.05,57.75
DISC  (via drill 0.3)
  Top 0.152: v14.4,96.3 14.4,97.65 16.95,97.65 UC1.46 | v18.3,58.35 15.3,55.35 v15.3,48.9 | 10.35,43.95 10.05,43.65 10.05,43.05 R33.1 | 10.35,43.95 8.4,43.95 R28.2 | 10.35,43.95 v10.5,44.1
  Bottom 0.152: v14.4,96.3 14.7,96 14.7,94.95 18,91.65 18,82.8 18.3,82.5 v18.3,58.35 | v10.5,44.1 v15.3,48.9
GND  (via drill 0.3)
  Top 0.152: UC1.8 12.1,98.1 | 12.1,98.1 17.09,98.1 UC1.47 | UC1.23 9.6,93.58 12.1,93.58 12.1,93.6 | 12.1,93.6 12.1,98.1 | UC1.35 15.1,93.6 12.1,93.6
  Top 0.381: C10.1 4.95,41.85 6.3,41.85 C11.1 6.45,42 6.45,43.95 R28.1 6.3,43.95 3.9,43.95 3.9,44.4 PWR.2 | 4.65,27 2.25,27 C1.1 | 4.65,27 4.65,27.3 U3.1 4.65,27.6 v3.9,28.35 | R39.2 16.2,31.5 16.2,28.8 R41.2 16.05,28.65 15.3,28.65 | 15.3,28.65 12,28.65 C18.1 12,25.95 9.6,25.95 9.6,26.1 U3.7 9.45,26.25 8.85,26.25 8.1,27 4.65,27 | JACK.1 7.65,4.05 11.25,4.05 11.25,4.5 12,5.25 14.25,5.25 14.85,4.65 21.6,4.65 21.6,6.75 X1.GND 21.6,6.9 21.6,12.15 20.25,13.5 20.25,20.25 U$14.- 20.25,20.4 15.3,25.35 15.3,28.65 | D1.C 4.35,58.95 4.5,59.1 4.5,61.8 3.6,62.7 U$9.- 5.25,64.5 5.25,70.95 5.55,71.25 5.7,71.25 | 12.15,71.4 9.6,71.4 U$29.2 9.45,71.25 5.7,71.25 | 12.15,71.4 12.15,74.4 11.1,75.45 9.6,75.45 U$28.2 10.05,75.6 10.05,79.5 11.25,79.5 13.65,81.9 OS6.E | 5.7,92.1 8.85,92.1 9.6,92.85 9.6,93.58 9.6,93.6 | 5.7,71.25 5.7,92.1 | IC2.1 19.05,40.35 17.25,40.35 C4.2 17.25,40.5 16.2,41.55 16.2,45 | C3.1 19.2,51.75 18.9,51.45 18.9,45.15 IC3.1 18.75,45 C9.2 16.2,45 | 16.2,45 C14.C 13.95,45.15 13.65,45.45 13.65,45.9 | 13.65,45.9 13.65,50.25 13.35,50.55 DAC.7 13.35,50.7 v13.35,53.1 | 18.45,61.95 R24.1 19.8,61.8 19.95,61.65 19.95,59.85 20.4,59.4 IC1.3 20.55,59.25 20.55,58.2 22.2,58.2 22.5,58.5 22.5,58.8 22.95,59.25 IC1.1 | 18.45,61.95 17.25,61.95 C2.1 17.1,61.8 16.05,60.75 16.05,60 13.8,60 OS7.E | v22.95,92.1 23.25,91.8 23.25,90.9 C8.2 23.25,90.75 21.75,89.25 21.75,81.45 20.55,80.25 20.55,76.95 22.8,74.7 22.8,73.5 21.75,72.45 U$2.1 21.6,72.3 21.45,72.15 21.45,69.9 20.55,69 C16.1 20.4,69 18.45,69 | 18.45,69 18.3,69 18.3,69.75 U$1.1 | 18.45,69 18.45,61.95 | v12.3,68.1 12.3,71.1 12.15,71.25 12.15,71.4
  Top 0.381: v9,50.85 10.05,49.8 10.05,49.35 13.5,45.9 13.65,45.9 | v20.7,227.1 20.7,227.25 U$24.GND 19.2,227.1 14.85,227.1 14.85,193.2 13.8,192.15 OS1.E 13.65,192 12.9,191.25 12.9,186.75 12.3,186.15 12.3,182.1 11.25,181.05 OS8.E | v4.65,239.85 4.65,241.05 P1.3 | 10.5,114 10.5,114.6 U2.7 | 10.5,114 10.5,113.4 U2.8 10.35,113.4 3.6,106.65 3.6,102.45 C21.1 3.45,102.3 2.4,101.25 2.4,98.7 | C7.1 1.35,89.25 1.35,90.75 C6.1 1.35,90.9 1.35,92.4 C12.1 1.35,92.55 1.35,94.2 1.5,94.35 C20.1 1.65,94.5 2.4,95.25 2.4,98.7 | v12.6,115.95 10.65,115.95 U2.6 | 10.05,136.05 10.05,136.65 U1.7 10.05,136.8 10.05,137.85 U1.6 | 10.05,136.05 10.05,135.45 U1.8 | v11.55,136.05 10.05,136.05 | OS2.E 13.8,169.95 14.85,168.9 14.85,149.1 13.8,148.05 OS3.E | v12.45,114 10.5,114 | 5.7,92.1 5.1,92.1 v5.1,92.25 | 2.4,98.7 v4.05,98.7
  Bottom 0.381: v3.9,28.35 3.9,44.4 PWR.2 3.75,44.55 2.4,45.9 2.4,49.5 3.75,50.85 v9,50.85 | v22.95,92.1 22.95,94.5 23.1,94.65 PROGRAM.1 | v13.35,53.1 13.65,53.4 13.65,59.85 OS7.E 13.95,60 14.85,60.9 14.85,65.55 v12.3,68.1 | U$23.A2 U$23.A1 12.45,211.65 | 12.45,211.65 U$22.A2 U$22.A1 | U$21.A2 3.75,219 9.9,219 U$21.A1 10.05,219 12.45,219 | 12.45,219 14.7,219 U$20.A2 14.85,219 21,219 U$20.A1 | 12.45,219 12.45,211.65 | v20.7,227.1 21,226.8 21,226.2 U$18.A1 20.85,226.2 14.85,226.2 U$18.A2 14.7,226.2 12.45,226.2 | 12.45,226.2 10.05,226.2 U$19.A1 9.9,226.2 3.75,226.2 U$19.A2 4.65,226.35 v4.65,239.85 | 12.45,226.2 12.45,219 | OS2.E 13.65,170.1 12.3,171.45 12.3,179.85 11.25,180.9 OS8.E | 12.6,114 12.6,105.15 13.65,104.1 OS5.E | 12.6,114 v12.6,115.95 12.45,115.95 10.65,117.75 10.65,124.95 10.05,125.55 10.05,127.35 12.97,130.28 | 12.97,130.28 12.6,130.65 12.6,132.6 14.25,134.25 14.25,136.05 | 12.97,130.28 13.5,129.75 13.5,126.15 13.65,126 OS4.E | 14.25,136.05 14.25,147.45 13.8,147.9 OS3.E | 14.25,136.05 v11.55,136.05 | v12.45,114 12.6,114 | v5.1,92.25 4.05,93.3 v4.05,98.7
HOLE1  (via drill 0.3)
  Top 0.152: OS1.C 9.6,192 R4.2 | v17.4,179.7 17.4,140.55 15.15,140.55 U1.13
  Bottom 0.152: v17.4,179.7 12.3,184.8 12.3,190.95 11.25,192 OS1.C
HOLE2  (via drill 0.3)
  Top 0.152: R17.2 9.45,170.1 11.1,170.1 OS2.C | v17.85,112.5 17.85,112.35 14.7,112.35 14.1,112.95 14.1,118.35 15.45,118.35 U2.13
  Bottom 0.152: v17.85,112.5 19.65,114.3 19.65,161.55 11.25,169.95 OS2.C
HOLE3  (via drill 0.3)
  Top 0.152: R16.2 9.3,148.05 11.1,148.05 OS3.C | v13.5,143.7 13.5,141.9 15,141.9 U1.14
  Bottom 0.152: v13.5,143.7 10.65,146.55 10.65,147.45 11.1,147.9 OS3.C
HOLE4
  Top 0.152: R14.2 9.75,126 11.1,126 OS4.C 11.25,125.85 11.85,125.25 11.85,119.7 U2.14
HOLE5  (via drill 0.3)
  Top 0.152: R6.1 9.75,103.8 11.1,103.8 11.1,103.95 OS5.C 11.25,104.1 11.25,105 14.1,105 14.25,104.85 17.1,104.85 17.7,105.45 17.7,107.1 v18.75,108.15 | v16.5,142.35 16.5,142.95 15.15,142.95 U1.15 | v19.8,113.55 v18.9,114.45
  Bottom 0.152: v16.5,142.35 18.9,139.95 v18.9,114.45 | v19.8,113.55 18.75,112.5 v18.75,108.15
HOLE6  (via drill 0.3)
  Top 0.152: R18.2 9.6,81.9 11.1,81.9 OS6.C 11.25,82.05 12,82.8 12,85.65 v9.3,85.65 | v13.35,120.45 13.35,120.9 15.45,120.9 U2.15 | v12.6,118.8 11.55,117.75 7.65,117.75 v7.65,117.9
  Bottom 0.152: v13.35,120.45 12.6,119.7 v12.6,118.8 | v7.65,117.9 7.5,117.75 7.5,89.25 9.3,87.45 v9.3,85.65
HOLE7  (via drill 0.3)
  Top 0.152: R15.2 9.45,59.85 11.1,59.85 OS7.C | v13.5,139.8 13.5,139.35 15,139.35 U1.12 | v4.95,85.95 4.95,71.4 3.75,70.2 v3.75,69.75
  Bottom 0.152: v13.5,139.8 6.75,139.8 6.75,153.75 6.45,154.05 3.3,154.05 3.3,87.6 v4.95,85.95 | v3.75,69.75 2.4,68.4 2.4,55.65 3,55.05 11.4,55.05 11.4,59.7 11.25,59.85 OS7.C
HOLE8  (via drill 0.3)
  Top 0.152: OS8.C 13.8,180.9 15.45,180.9 R13.2 15.6,180.9 15.6,151.35 v15.9,151.05 | v15.9,133.95 16.8,133.05 16.8,117.3 15.6,117.3 U2.12
  Bottom 0.152: v15.9,133.95 15.75,134.1 15.75,150.9 v15.9,151.05
HOLES_EN1  (via drill 0.3)
  Top 0.152: v14.85,99 14.55,99.3 14.55,100.05 UC1.3 | v14.55,75.45 13.2,74.1 13.2,73.65 R1.1
  Bottom 0.152: v14.85,99 12.45,96.6 12.45,86.7 15.9,83.25 15.9,81.3 16.8,80.4 16.8,80.1 14.55,77.85 v14.55,75.45
HOLES_EN2  (via drill 0.3)
  Top 0.152: v13.8,98.85 14.1,99.15 14.1,100.05 UC1.4 | v9,91.35 6.3,88.65 6.3,73.95 7.95,72.3 v11.4,72.3 | v13.05,70.65 13.05,69.45 R2.1
  Bottom 0.152: v13.8,98.85 11.4,96.45 11.4,93.75 v9,91.35 | v13.05,70.65 v11.4,72.3
HOLES_GND1  (via drill 0.3)
  Top 0.152: v10.65,74.7 7.35,74.7 U$28.3 | v12.75,128.85 12.3,129.3 12.3,173.7 13.65,175.05 OS2.K 10.2,178.65 10.2,186.45 12.3,188.55 12.3,195.6 13.65,196.95 OS1.K | v19.2,89.85 v17.25,89.85 | v21.9,97.65 23.1,98.85 23.1,100.8 v22.35,101.55 | v16.95,106.95 13.8,106.95 13.8,108.9 OS5.K
  Bottom 0.152: v10.65,74.7 15.3,74.7 15.3,78 17.25,79.95 17.25,81.75 16.35,82.65 16.35,84.45 14.1,86.7 | 14.1,86.7 13.8,87 OS6.K 14.1,86.7 | v12.75,128.85 12.75,125.55 14.1,124.2 14.1,109.35 13.8,109.05 OS5.K | v17.25,89.85 14.1,86.7 | v19.2,89.85 21.9,92.55 v21.9,97.65 | v16.95,106.95 v22.35,101.55
HOLES_GND2  (via drill 0.3)
  Top 0.152: v10.8,70.65 10.8,70.35 7.35,70.35 U$29.3 7.2,70.35 6,70.35 v6,70.5 | OS4.K 13.65,131.1 12.75,132 12.75,152.1 13.65,153 OS3.K
  Bottom 0.152: v10.8,70.65 11.55,69.9 11.55,67.2 13.65,65.1 OS7.K | 10.2,159.45 10.2,185.1 11.1,186 OS8.K | 10.2,159.45 13.8,155.85 13.8,153.15 OS3.K | v6,70.5 5.1,71.4 5.1,84.9 2.85,87.15 2.85,156.15 4.35,157.65 10.2,157.65 10.2,159.45
KEY  (via drill 0.3)
  Top 0.152: v20.55,194.7 20.55,103.35 18,100.8 18,97.05 17.1,97.05 UC1.45 | v11.85,203.4 6.75,208.5 6.75,209.25 U$24.KEY
  Bottom 0.152: v11.85,203.4 v20.55,194.7
MUX1  (via drill 0.3)
  Top 0.152: v10.65,99 10.65,100.05 UC1.11 | v14.85,123.3 12.3,125.85 12.3,126.9 8.7,130.5 8.7,140.85 9.6,141.75 10.05,141.75 U1.3
  Bottom 0.152: v10.65,99 13.05,99 13.05,101.1 14.85,102.9 v14.85,123.3
MUX2  (via drill 0.3)
  Top 0.152: v9,101.25 10.05,100.2 UC1.12 | v8.7,119.55 10.5,119.55 10.5,119.7 U2.3
  Bottom 0.152: v9,101.25 8.4,101.85 8.4,117.15 8.85,117.6 8.85,119.4 v8.7,119.55
N$1
  Top 0.152: 4.65,25.05 2.25,25.05 C1.2 | 4.65,25.05 4.65,24.9 U3.3 4.65,25.05 | 4.65,25.05 4.65,26.1 U3.2
N$2
  Top 0.152: R22.2 2.7,21.9 4.65,21.9 R21.1 4.8,22.05 4.8,23.55 U3.4
N$3
  Top 0.152: R1.2 11.25,73.65 9.6,73.65 U$28.1
N$4
  Top 0.152: R2.2 11.25,69.45 9.6,69.45 U$29.1
N$5
  Top 0.152: R3.2 9.6,197.1 11.1,197.1 OS1.A
N$6
  Top 0.152: D5.A 1.35,53.55 R27.2
N$7
  Top 0.152: R7.1 9.6,175.2 11.1,175.2 OS2.A
N$8
  Top 0.152: R19.2 13.5,10.8 12.75,10.05 12.75,9 JACK.5
  Bottom 0.152: JACK.2 2.7,9 3.6,9.9 3.6,10.05 3.9,10.35 12.6,10.35 12.6,9 JACK.5
N$9
  Top 0.152: R10.1 9.3,153.15 11.1,153.15 OS3.A
N$10
  Top 0.152: C17.2 3,18.3 2.7,18.6 2.7,20.1 R22.1
N$11
  Top 0.152: R11.1 9.75,131.1 11.1,131.1 OS4.A
N$12  (via drill 0.3)
  Top 0.152: v9.45,28.35 9.45,27.45 U3.8
  Bottom 0.152: v9.45,28.35 8.4,27.3 8.4,20.85 SPEAKER.2
N$13
  Top 0.152: R5.2 9.6,109.05 11.1,109.05 OS5.A
N$15
  Top 0.152: R8.1 9.75,87 11.1,87 OS6.A
N$16
  Top 0.152: R26.2 1.35,49.8 1.35,51.6 D4.A
N$17
  Top 0.152: R9.1 9.45,65.1 11.1,65.1 OS7.A
N$19
  Top 0.152: R12.1 15.45,186 13.8,186 OS8.A
N$21
  Top 0.152: R24.2 21.6,61.95 21.6,59.4 IC1.2
N$22
  Top 0.152: C15.1 17.4,73.2 18.15,72.45 18.15,71.85 U$1.3
N$24  (via drill 0.3)
  Top 0.152: v19.65,48 21.75,50.1 21.75,53.7 IC1.7 | v5.7,49.35 4.5,50.55 4.5,51.6 D4.C
  Bottom 0.152: v19.65,48 15,48 11.25,44.25 11.25,42.45 6.75,37.95 5.7,37.95 v5.7,49.35
N$25  (via drill 0.3)
  Top 0.152: v20.1,50.7 20.1,53.4 20.4,53.7 IC1.6 | v6,53.25 4.35,54.9 D5.C
  Bottom 0.152: v20.1,50.7 16.95,50.7 16.05,51.6 6,51.6 v6,53.25
N$26
  Top 0.152: R38.2 19.35,33.3 BUT.P$3 19.5,33.45 23.55,33.45 BUT.P$1
N$27
  Top 0.152: R41.1 18,28.8 18,28.65 19.35,28.65 RESET.P$3 19.5,28.65 23.55,28.65 RESET.P$1
N$28
  Top 0.152: D1.A 1.35,57.15 R30.2
N$29  (via drill 0.3)
  Top 0.152: v10.8,77.25 10.8,78.9 12.15,78.9 15.9,82.65 15.9,85.65 16.5,86.25 16.5,89.4 15.45,89.4 14.55,90.3 14.55,91.5 UC1.34 | v3.75,60.3 3.3,59.85 3.3,57.15 R30.1
  Bottom 0.152: v10.8,77.25 9.15,75.6 9.15,65.7 v3.75,60.3
N$30
  Top 0.152: U$1.5 15.75,69.9 16.65,70.8 16.65,72.15 15.6,73.2 C15.2
N$31
  Top 0.152: 19.2,70.8 20.4,70.8 C16.2 | 19.2,70.8 18.3,70.8 U$1.2 | 19.2,70.8 19.2,73.2 U$2.3
N$59  (via drill 0.3)
  Top 0.152: v4.65,36 4.65,39.75 4.8,39.9 R31.1 | v19.2,8.7 19.2,6.9 X1.D-
  Bottom 0.152: v4.65,36 4.65,20.1 16.05,8.7 v19.2,8.7
N$60
  Top 0.152: R32.1 6.3,40.05 5.55,40.8 3.9,40.8 3.9,30.15 1.2,27.45 1.2,21.9 2.25,20.85 3.75,20.85 3.75,19.65 4.2,19.2 6.75,19.2 6.75,18 12.9,11.85 14.55,11.85 14.55,10.2 16.35,8.4 17.85,8.4 17.85,5.55 18.15,5.25 19.95,5.25 19.95,6.75 X1.D+
OSC_IN
  Top 0.152: UC1.5 13.5,100.2 13.5,101.55 12.3,102.75 8.85,102.75 8.85,105.3 12.75,109.2 12.75,112.95 13.35,113.55 13.35,114.3 12.3,115.35 11.7,115.35 11.55,115.2 1.8,115.2 1.8,102.45 C21.2 1.65,102.3 1.65,100.5 1.5,100.35 OSC.3
OSC_OUT
  Top 0.152: UC1.6 13.05,100.2 13.05,101.4 12.45,102 6.75,102 6.75,100.5 3.75,97.5 3.75,96.75 OSC.1 3.6,96.6 3.6,94.65 3.45,94.5 C20.2
PRESSURE  (via drill 0.3)
  Top 0.152: v11.1,101.25 11.1,100.2 UC1.10 | v13.5,134.7 17.1,134.7 17.1,134.25 17.7,133.65 19.8,133.65 19.8,208.05 21.45,209.7 21.45,227.25 10.2,238.5 4.65,238.5 P1.4
  Bottom 0.152: v11.1,101.25 10.2,102.15 10.2,104.55 10.5,104.85 10.5,108.3 10.05,108.75 10.05,120.15 9.45,120.75 9.45,130.65 v13.5,134.7
RESET  (via drill 0.3)
  Top 0.152: RESET.P$2 RESET.P$4 18,27 R40.2 17.25,27.75 17.25,34.05 17.85,34.65 23.7,34.65 23.7,65.55 v21.3,67.95 | v17.85,104.1 14.85,104.1 14.85,103.65 13.65,102.45 v13.5,102.45 | v12.3,101.25 12.6,100.95 12.6,100.2 UC1.7 | v19.05,83.55 20.7,85.2 20.7,97.35 v22.35,99
  Bottom 0.152: v17.85,104.1 19.05,104.1 19.65,103.5 19.65,103.35 23.1,99.9 PROGRAM.3 23.1,99.75 v22.35,99 | v12.3,101.25 v13.5,102.45 | v21.3,67.95 21.15,68.1 21.15,76.5 19.05,78.6 v19.05,83.55
RX1  (via drill 0.3)
  Top 0.152: v15.9,96.9 14.4,95.4 v14.4,94.35 | v13.65,92.7 13.05,92.1 13.05,91.65 UC1.31
  Bottom 0.152: v15.9,96.9 16.65,96.15 16.65,94.8 20.55,94.8 PROGRAM.6 | v14.4,94.35 13.65,93.6 v13.65,92.7
TX1  (via drill 0.3)
  Top 0.152: v16.35,90.9 v19.2,90.9 | v13.2,89.55 12.6,90.15 12.6,91.5 UC1.30
  Bottom 0.152: v19.2,90.9 21.45,93.15 21.45,96.45 20.7,97.2 PROGRAM.5 | v16.35,90.9 13.2,90.9 v13.2,89.55
USB+  (via drill 0.3)
  Top 0.152: C2.2 17.25,60 19.05,60 19.05,59.4 IC1.4 19.05,59.25 19.05,55.35 v18.75,55.05 | v21.3,36.75 21.3,35.4 D2.2 | v21,50.25 21,51.75 R25.2 | v18.45,19.2 18.45,6.9 X1.VBUS
  Bottom 0.152: v18.75,55.05 21,52.8 v21,50.25 21,37.05 v21.3,36.75 21.3,22.05 v18.45,19.2
USBDM  (via drill 0.3)
  Top 0.152: v15.3,86.85 15.3,88.35 13.65,90 13.65,91.5 UC1.32 | v16.65,85.5 16.35,85.2 16.35,83.55 v17.55,82.35 | v6.75,52.35 6.45,52.05 6.45,47.85 4.2,45.6 2.55,45.6 2.55,42.3 3,41.85 C10.2 3.15,41.7 3.15,39.9 R31.2
  Bottom 0.152: v16.65,85.5 v15.3,86.85 | v17.55,82.35 17.7,82.2 17.7,76.5 15.45,74.25 15.45,57.3 14.25,56.1 14.25,52.8 13.65,52.2 6.75,52.2 v6.75,52.35
USBDP  (via drill 0.3)
  Top 0.152: v13.8,84.45 16.05,86.7 16.05,88.2 14.1,90.15 14.1,91.5 UC1.33 | v8.4,66.15 8.4,51.15 8.25,51 v8.25,48.3 | v8.1,45.3 7.5,44.7 7.5,42.6 C11.2 8.1,41.85 8.1,41.25 | 8.1,41.25 R32.2 | 8.1,41.25 9.9,41.25 R33.2
  Bottom 0.152: v13.8,84.45 10.5,84.45 10.5,82.8 8.4,80.7 v8.4,66.15 | v8.25,48.3 8.1,48.15 v8.1,45.3
VCC  (via drill 0.3)
  Top 0.381: R26.1 3.15,49.8 3.15,53.4 R27.1 3.3,53.55 v4.8,53.55 | v20.4,71.7 20.4,72.9 21.6,74.1 U$2.2 | v15.45,56.4 14.7,55.65 14.7,55.35 DAC.1 14.4,55.2 14.4,53.85 v11.4,53.85 | v4.5,65.55 4.5,66.6 3.6,67.5 U$9.+ | v2.25,156.45 2.25,158.7 4.5,160.95 4.5,232.35 1.5,235.35 1.5,243.6 4.5,243.6 P1.2
  Bottom 0.381: v20.4,71.7 19.05,70.35 19.05,57.9 17.55,56.4 v15.45,56.4 | v11.4,53.85 11.4,54 5.25,54 v4.8,53.55 3.75,53.55 1.8,55.5 1.8,70.5 4.2,70.5 4.5,70.2 | 4.5,70.2 v4.5,65.55 | v2.25,156.45 2.25,82.5 4.5,80.25 4.5,70.2
VIN  (via drill 0.3)
  Top 0.381: 13.88,22.12 14.7,21.3 14.7,20.25 U$14.+ | 13.88,22.12 12,24 C18.2 11.85,24.15 11.85,24.75 9.6,24.75 U3.6 | v20.1,40.65 21.45,40.65 D3.2 | 14.78,39.23 12.3,36.75 U$16.B2 | 14.78,39.23 15.07,39.52 | 15.07,39.52 v16.05,40.5 | U$16.B1 12.3,30.6 15.15,30.6 15.15,39.45 15.07,39.52 | 13.88,22.12 15.45,23.7 v15.45,23.85 | 7.65,66.9 12.3,66.9 14.1,68.7 14.1,70.2 15.6,71.7 U$1.4 | 7.65,66.9 7.65,65.1 R9.2 7.5,64.95 7.5,60 R15.1 7.5,59.7 7.5,47.55 8.25,47.55 11.25,44.55 11.25,42.75 14.78,39.23 | v7.65,80.4 7.65,81.75 R18.1 7.8,82.05 7.8,87 R8.2 7.8,87.15 7.65,87.3 v7.65,88.2 | v7.65,67.05 7.65,66.9 | R13.1 17.4,181.05 17.4,185.85 R12.2 17.4,186.15 17.1,186.45 v17.1,190.2 | R3.1 7.8,195.75 | 7.8,195.75 7.8,192.15 R4.1 7.65,192 7.65,175.2 R7.2 7.65,175.05 7.65,170.1 R17.1 7.5,169.95 7.5,153.3 R10.2 7.5,153 7.5,148.2 R16.1 7.5,147.9 7.5,131.25 7.65,131.1 R11.2 7.8,130.95 7.8,126 R14.1 7.95,125.85 7.95,125.7 v8.7,124.95 | 7.8,195.75 v11.55,195.75 | v9.15,111 9.15,110.7 7.65,109.2 R5.1 7.8,108.9 7.8,103.8 R6.2 7.65,103.65 v5.7,101.7
  Bottom 0.381: 16.95,40.65 16.05,40.65 v16.05,40.5 | 16.95,40.65 v20.1,40.65 | v15.45,23.85 16.95,25.35 16.95,40.65 | v7.65,67.05 v7.65,80.4 | v11.55,195.75 v17.1,190.2 | v9.15,111 9.45,111.3 9.45,120 8.7,120.75 v8.7,124.95 | v7.65,88.2 5.85,90 5.85,101.55 v5.7,101.7
VIN_BAT  (via drill 0.3)
  Top 0.381: U$16.A1 7.2,30.6 4.5,30.6 4.5,34.65 6.3,36.45 7.2,36.45 U$16.A2 6.6,36.6 v6.6,38.7 | IC1.5 19.05,53.7 19.05,53.4 17.55,51.9 C3.2 17.4,51.75 v16.05,50.4
  Bottom 0.381: v16.05,50.4 9.75,50.4 9.45,50.1 6.6,50.1 | 6.6,50.1 3.9,50.1 3.9,46.95 PWR.1 | 6.6,50.1 v6.6,38.7
VIN_REGS  (via drill 0.3)
  Top 0.381: 21,43.5 21.45,43.05 D3.1 21.6,42.9 22.35,42.15 22.35,40.2 21.3,39.15 IC2.3 21.15,37.8 21.3,37.65 D2.1 | 21,43.5 21,44.1 IC3.3 | v15.45,42.3 14.1,42.3 C14.A | v19.65,42.3 20.85,43.5 21,43.5
  Bottom 0.381: v19.65,42.3 v15.45,42.3
VOUTA
  Top 0.152: 7.05,20.1 7.2,20.1 7.2,19.35 8.25,18.3 SPEAKER.1 | 7.05,20.1 4.8,20.1 R21.2 | 7.05,20.1 7.05,23.55 9.45,23.55 U3.5

### Text on the board
tSilk: GND